# EAGLE design osuar_pdb (EAGLE 6.5.0)
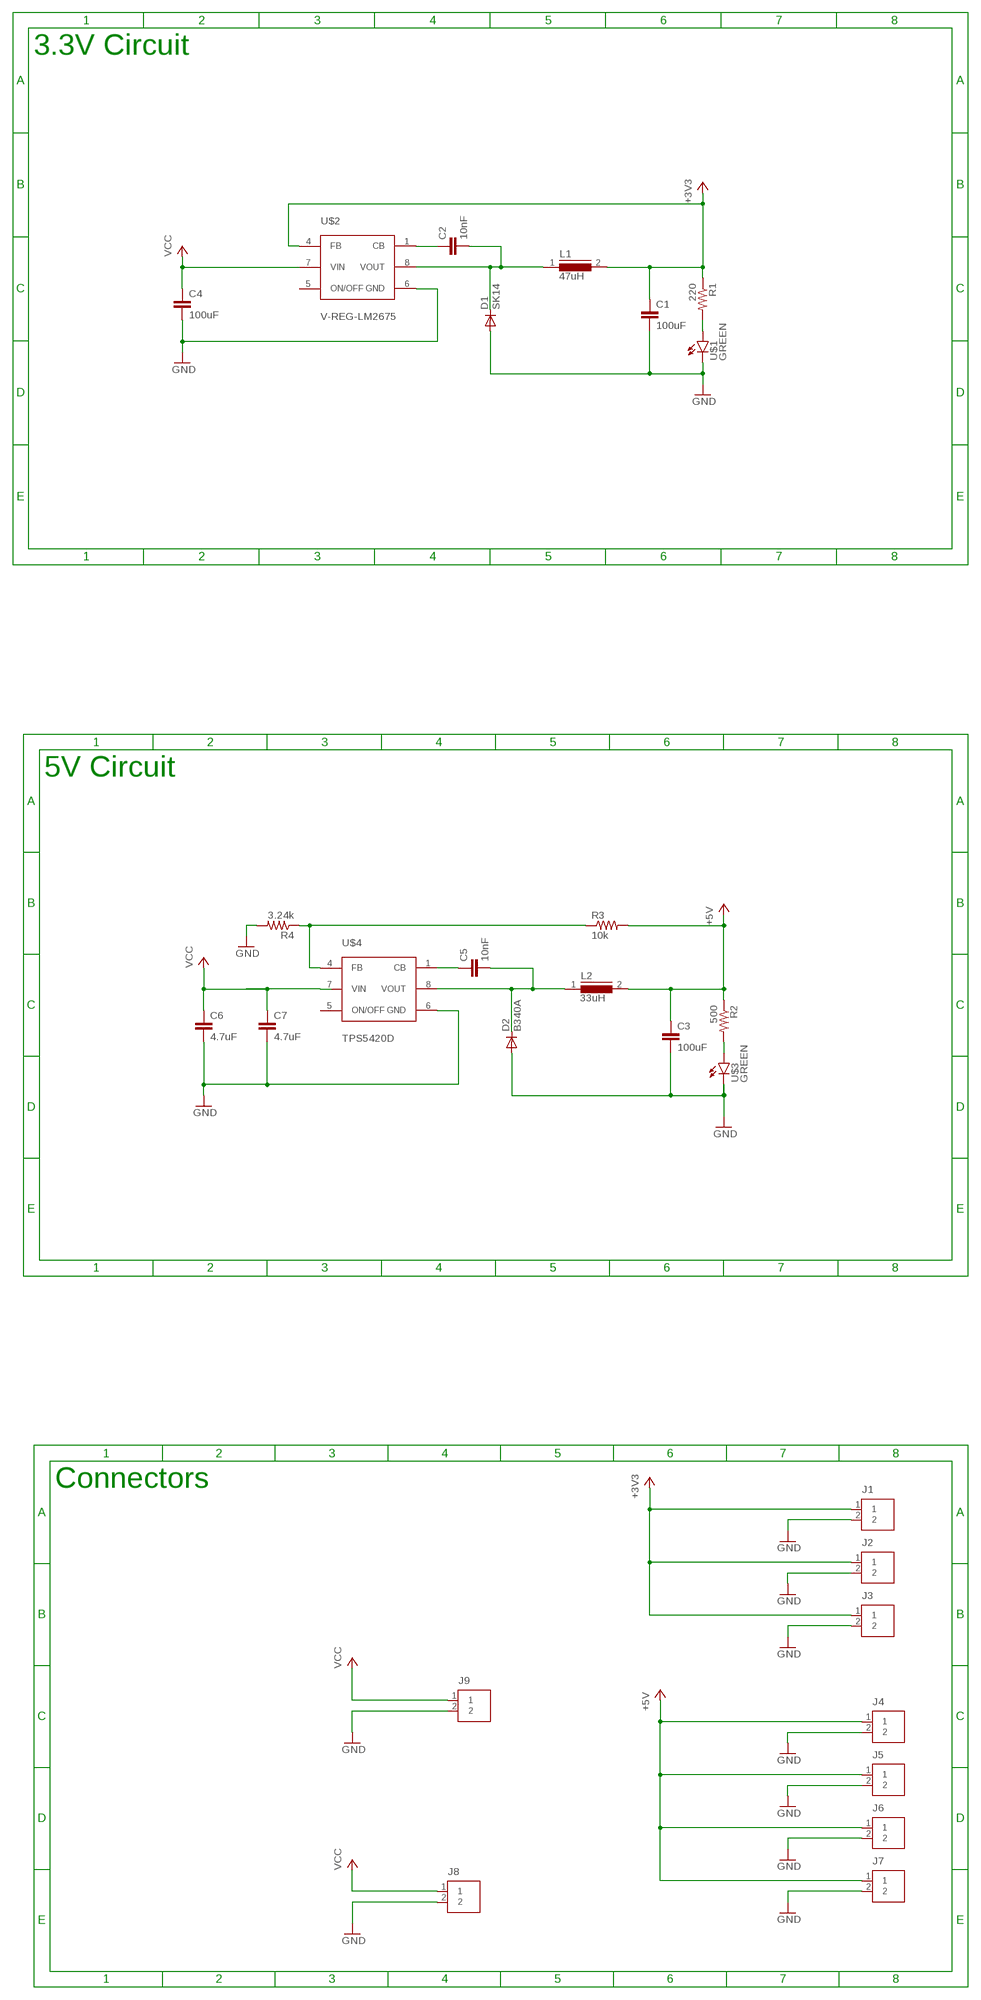
[diagram p0: schematic, sheet 1]

## Parts
C1  100uF  CAP-10UF-10V-10%(0805)  [0805]
C2  10nF  CAP-10NF-50V-10%(0603)  [0603]
C3  100uF  CAP-10UF-10V-10%(0805)  [0805]
C4  100uF  CAP-10UF-10V-10%(0805)  [0805]
C5  10nF  CAP-10NF-50V-10%(0603)  [0603]
C6  4.7uF  CAP-10UF-10V-10%(0805)  [0805]
C7  4.7uF  CAP-10UF-10V-10%(0805)  [0805]
D1  SK14  DIODE-DO214AA  [DO214AA]
D2  B340A  DIODE-DO214AA  [DO214AA]
J1  M02  [MOLEX-2MM-MICROLATCH-2POS-RA]
J2  M02  [MOLEX-2MM-MICROLATCH-2POS-RA]
J3  M02  [MOLEX-2MM-MICROLATCH-2POS-RA]
J4  M02  [MOLEX-2MM-MICROLATCH-2POS-RA]
J5  M02  [MOLEX-2MM-MICROLATCH-2POS-RA]
J6  M02  [MOLEX-2MM-MICROLATCH-2POS-RA]
J7  M02  [MOLEX-2MM-MICROLATCH-2POS-RA]
J8  M02  [MOLEX-2MM-MICROLATCH-2POS-RA]
J9  M02  [MOLEX-2MM-MICROLATCH-2POS-RA]
L1  47uH  DR125  [DR125]
L2  33uH  DR125  [DR125]
R1  220  RES-1.1KOHM-0.1W-5%(0603)  [0603]
R2  500  RES-1.1KOHM-0.1W-5%(0603)  [0603]
R3  10k  RES-20KOHM-0.1W-0.1%(0603)  [0603]
R4  3.24k  RES-20KOHM-0.1W-0.1%(0603)  [0603]
U$1  GREEN  LED-KINGBRIGHT-HELI-GREEN(0603)  [LED-0603]
U$2  V-REG-LM2675  [SOIC8]
U$3  GREEN  LED-KINGBRIGHT-HELI-GREEN(0603)  [LED-0603]
U$4  TPS5420D  V-REG-TPS5420D  [SOIC8]

## Nets
+3V3: C1.2 J1.1 J2.1 J3.1 L1.2 R1.1 U$2.4(FB)
+5V: C3.2 J4.1 J5.1 J6.1 J7.1 L2.2 R2.1 R3.2
GND: C1.1 C3.1 C4.1 C6.1 C7.1 D1.A D2.A J1.2 J2.2 J3.2 J4.2 J5.2 J6.2 J7.2 J8.2 J9.2 R4.2 U$1.C U$2.6(GND) U$3.C U$4.6(GND)
N$1: C5.1 D2.C L2.1 U$4.8(VOUT)
N$2: C2.2 U$2.1(CB)
N$3: R1.2 U$1.A
N$5: C5.2 U$4.1(CB)
N$7: C2.1 D1.C L1.1 U$2.8(VOUT)
N$8: R2.2 U$3.A
N$11: R3.1 R4.1 U$4.4(FB)
VCC: C4.2 C6.2 C7.2 J8.1 J9.1 U$2.7(VIN) U$4.7(VIN)
Unconnected: U$2.5(ON/OFF) U$4.5(ON/OFF)

## Notes on the sheet
- 3.3V Circuit
- 5V Circuit
- Connectors

## Library data of the parts
C1 C3 C4 C6 C7 = OSURC_Passives:CAP; DIGIKEY_PN: 490-1709-1-ND; VALUE: 10uF
C2 C5 = OSURC_Passives:CAP; DIGIKEY_PN: 490-1512-1-ND
D1 D2 = diode:DIODE-: DIODE
J1-J9 = OSURC_Connectors:M02; DIGIKEY_PN: WM18999-ND
L1 L2 = inductors:DR125: High Power Density, High Efficiency, Shielded Inductors Source: coiltronics_dr_series.pdf
R1 R2 = OSURC_Passives:RES; DIGIKEY_PN: P1.1KGCT-ND; VALUE: 1.1k
R3 R4 = OSURC_Passives:RES; DIGIKEY_PN: P20KDBCT-ND; VALUE: 20k
U$1 U$3 = OSURC_LED:LED-KINGBRIGHT-HELI: Kingbright HELI series LEDs. 0603 package, hella bright.; DIGIKEY_PN: 754-1790-1-ND
U$2 = OSURC_PowerIC:V-REG-LM2675: LM2675 switching regulator. 3.3V, 5V, 12V configurations. 1A max Datasheet: http://www.ti.com/lit/ds/symlink/lm2675.pdf; MOUSER#: 926-LM2675MX33NOPB; VALUE: LM2675MX-3.3
U$4 = OSURC_PowerIC:V-REG-TPS5420D: TI TPS5420D adj reg; DESCRIPTION: Adjustable switching regulator, 2A max draw Datasheet: http://www.ti.com/lit/ds/symlink/tps5420-q1.pdf; MOUSER#: 595-TPS5420D

## Board
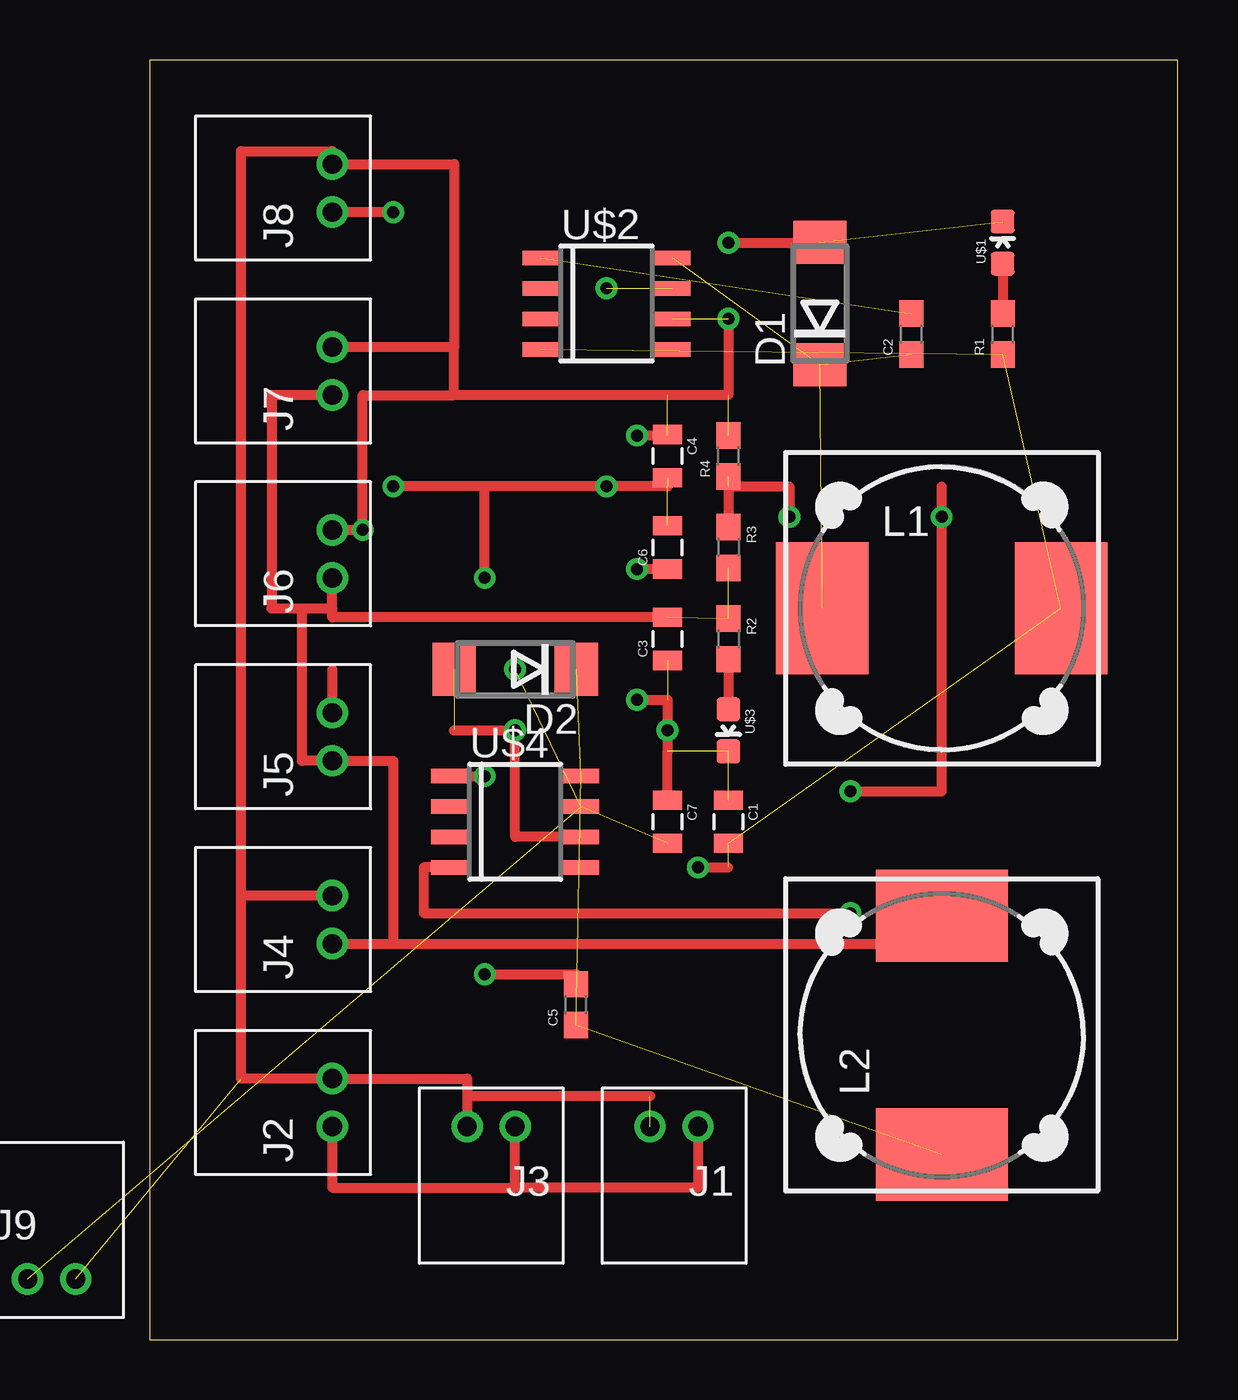
[diagram p1: board, top side]
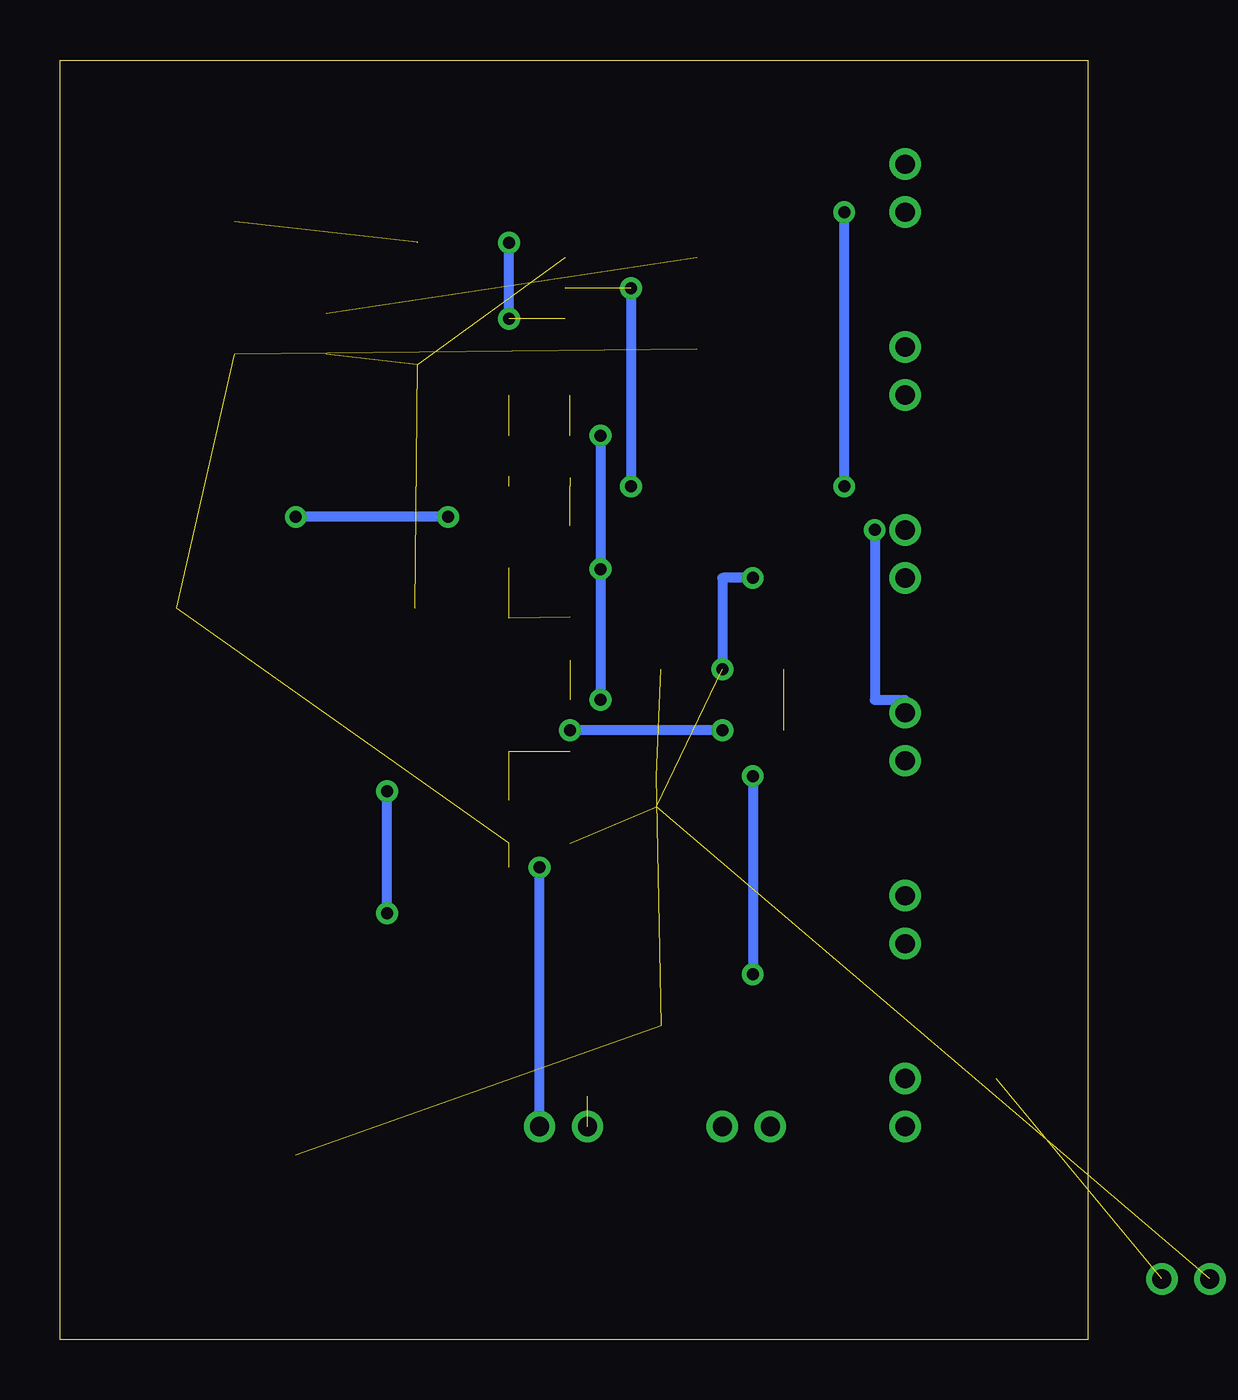
[diagram p2: board, bottom side, seen from below]

Size 42.85 x 53.33 mm. Coordinates in mm from the lower left corner, seen from the top.
Outline: 0,0 42.85,0 42.85,53.33 0,53.33 0,0
Copper layers (1*16): Top 0.035mm / dielectric 1.5mm / Bottom 0.035mm
Design rules "default": minimum track width 10mil, minimum drill 24mil, track to track 8mil, track to pad 8mil, pad to pad 8mil, via to via 8mil, smd to smd 8mil, copper to edge 40mil, drill to drill 8mil, minimum pad ring 10mil, minimum via ring 8mil, stop-mask expansion 4mil, vias tented up to drill 0mil, thermal gap 10mil

### Footprints (pad centres in the part's own frame; a part is rotated, then mirrored left to right if it is on the bottom)
0805 = smd 0.8 x 1.2: 1 -0.9,0; 2 0.9,0
0603 = smd 1.1 x 1: 1 -0.85,0; 2 0.85,0
DO214AA = smd 1.8 x 2.2: A 2.55,0; C -2.55,0
MOLEX-2MM-MICROLATCH-2POS-RA = drill 0.8: 1 0,0; 2 2,0
DR125 = smd 3.85 x 5.5: 1 -4.975,0; 2 4.975,0
LED-0603 = smd 1 x 1: A 0,-0.877; C 0,0.877
SOIC8 = smd 0.6 x 1.5: 1 -1.905,-2.75; 2 -0.635,-2.75; 3 0.635,-2.75; 4 1.905,-2.75; 5 1.905,2.75; 6 0.635,2.75; 7 -0.635,2.75; 8 -1.905,2.75

### Placement (x,y rotation side)
C1  24.13,21.59 270 top
C2  31.75,41.91 90 top
C3  21.59,29.21 90 top
C4  21.59,36.83 270 top
C5  17.78,13.97 90 top
C6  21.59,33.02 90 top
C7  21.59,21.59 270 top
D1  27.94,43.18 90 top
D2  15.24,27.94 180 top
J1  22.86,8.89 180 top
J2  7.62,8.89 90 top
J3  15.24,8.89 180 top
J4  7.62,16.51 90 top
J5  7.62,24.13 90 top
J6  7.62,31.75 90 top
J7  7.62,39.37 90 top
J8  7.62,46.99 90 top
J9  -5.08,2.54 0 top  (outside the outline)
L1  33.02,30.48 0 top
L2  33.02,12.7 90 top
R1  35.56,41.91 90 top
R2  24.13,29.21 270 top
R3  24.13,33.02 270 top
R4  24.13,36.83 90 top
U$1  35.56,45.72 0 top
U$2  19.05,43.18 270 top
U$3  24.13,25.4 180 top
U$4  15.24,21.59 270 top

### Tracks (layer width: path | path; a pad name or v marks a point on that pad's centre or on a via)
+3V3  (via drill 0.5)  (4 unrouted)
  Top 0.406: v22.86,19.68 24.13,19.68 | J1.1 22.86,6.35 15.24,6.35 | 15.24,6.35 J3.1 | J2.1 7.62,6.35 15.24,6.35
  Bottom 0.406: J1.1 v22.86,19.68
+5V  (2 unrouted)
  Top 0.406: 21.59,30.06 C3.2 7.62,30.11 7.62,30.48 | 7.62,30.48 J6.1 | J4.1 10.16,16.51 | 10.16,16.51 33.02,16.51 L2.2 | J7.1 5.08,39.37 5.08,30.48 6.35,30.48 | 6.35,30.48 7.62,30.48 | 10.16,16.51 10.16,24.13 J5.1 6.35,24.13 6.35,30.48
GND  (via drill 0.5)  (12 unrouted)
  Top 0.406: v24.13,45.72 D1.A | v24.13,42.55 24.13,39.37 21.59,39.37 12.7,39.37 | 12.7,41.37 12.7,48.99 J8.2 7.62,49.53 3.81,49.53 3.81,18.51 | 12.7,39.37 12.7,41.37 | 12.7,41.37 J7.2 | C7.1 21.59,24.52 v21.59,25.4 21.59,26.67 v20.32,26.67 | C6.1 v20.32,32.12 | 21.59,37.68 v20.32,37.68 | 12.7,39.37 8.89,39.37 v8.89,33.75 J6.2 | 13.24,10.16 13.24,10.89 J2.2 3.81,10.89 3.81,18.51 | 13.24,10.16 J3.2 | 20.86,10.16 13.24,10.16 | J4.2 3.81,18.51 | 7.62,27.94 J5.2 | 12.69,25.4 v15.24,25.4 15.24,20.96 U$4.6
  Bottom 0.406: v24.13,42.55 v24.13,45.72 | v20.32,26.67 v20.32,32.12 v20.32,37.68 | v8.89,33.75 8.89,26.67 7.62,26.67 J5.2 | v15.24,25.4 v21.59,25.4
N$1  (3 unrouted)
N$2  (1 unrouted)
N$3
  Top 0.406: U$1.A R1.2
N$5  (via drill 0.5)
  Top 0.406: U$4.1 v13.97,23.5 | v13.97,15.24 17.78,15.24 C5.2
  Bottom 0.406: v13.97,23.5 v13.97,15.24
N$6  (via drill 0.5)
  other vias: 15.24,27.94
N$7  (3 unrouted)
N$8
  Top 0.406: R2.2 U$3.A
N$11  (via drill 0.5)  (1 unrouted)
  Top 0.406: R3.1 24.13,35.56 26.67,35.56 v26.67,34.29 | U$4.4 11.43,19.68 11.43,17.78 v29.21,17.78 | v29.21,22.86 33.02,22.86 v33.02,34.29 33.02,35.56
  Bottom 0.406: v29.21,17.78 v29.21,22.86 | v26.67,34.29 v33.02,34.29
VCC  (via drill 0.5)  (6 unrouted)
  Top 0.406: 21.59,35.56 v19.05,35.56 13.97,35.56 | 13.97,35.56 v10.16,35.56 | v10.16,46.99 J8.1 | v13.97,31.75 13.97,35.56
  Bottom 0.406: v10.16,35.56 v10.16,46.99 | v19.05,43.81 v19.05,35.56 | v13.97,31.75 15.24,31.75 15.24,27.94